# EAGLE design schematicFORLAMP (EAGLE 9.6.2)
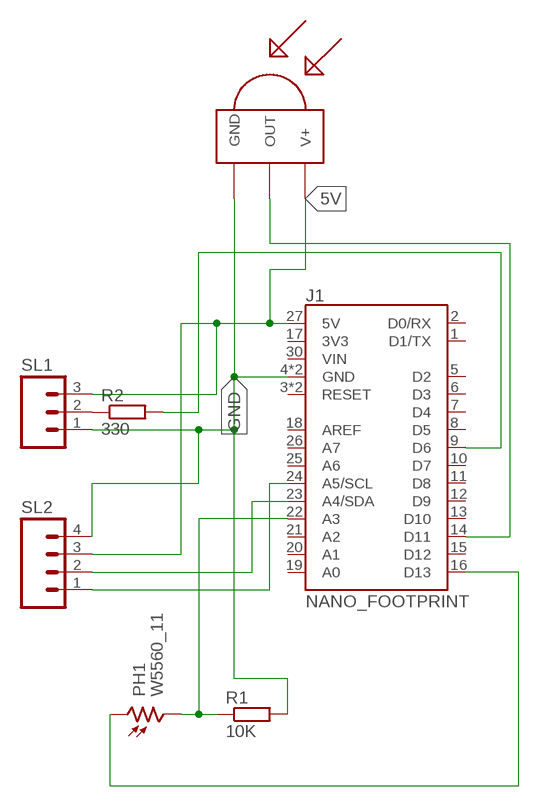
[diagram p0: schematic, sheet 1]

## Parts
J1  NANO_FOOTPRINT  [NANO]
PH1  W5560_11  [W55XX]
R1  10K  R-EU_0207/10  [0207/10]
R2  330  R-EU_0207/10  [0207/10]
SL1  M03  [03P]
SL2  M04  [04P]
U$1  TSOP1838  [TSOP18XX]

## Nets
5V: J1.27(5V) SL1.3 SL2.3 U$1.VCC(V+)
GND: J1.4(GND) J1.29(GND) R1.2 SL1.1 SL2.4 U$1.GND
N$1: R2.1 SL1.2
N$3: J1.9(D6) R2.2
N$5: J1.22(A3) PH1.2 R1.1
N$6: J1.14(D11) U$1.OUT
N$8: J1.16(D13) PH1.1
N$10: J1.23(A4/SDA) SL2.2
N$11: J1.24(A5/SCL) SL2.1
Unconnected: J1.1(D1/TX) J1.2(D0/RX) J1.3(RESET) J1.5(D2) J1.6(D3) J1.7(D4) J1.8(D5) J1.10(D7) J1.11(D8) J1.12(D9) J1.13(D10) J1.15(D12) J1.17(3V3) J1.18(AREF) J1.19(A0) J1.20(A1) J1.21(A2) J1.25(A6) J1.26(A7) J1.28(RESET) J1.30(VIN)

## Library data of the parts
J1 = SparkFun-Boards:NANO_FOOTPRINT: Generic Nano Footprint
PH1 = photo-elements:W55: Photo Sensor Oil Burner Control Applications Source: http://optoelectronics.perkinelmer.com/content/Datasheets/DTS_PhotocellsD1160.pdf
R1 R2 = rcl:R-EU_: RESISTOR, European symbol; SPICEPREFIX: R
SL1 = con-amp-quick:M03: AMP QUICK CONNECTOR; OC_FARNELL: unknown; OC_NEWARK: unknown
SL2 = con-amp-quick:M04: AMP QUICK CONNECTOR; OC_FARNELL: unknown; OC_NEWARK: unknown
U$1 = TSOP1838:TSOP1838: IR Receiver and Demodulator Check availability <https://pricing.snapeda.com/parts/TSOP1838/Vishay%20Semiconductors/view-part?ref=eda>; AVAILABILITY: Not in stock; DESCRIPTION: Infrared Receivers IR REMOTE SYS; MF: Vishay Semiconductors; MP: TSOP1838; PACKAGE: None; PRICE: None

## Board
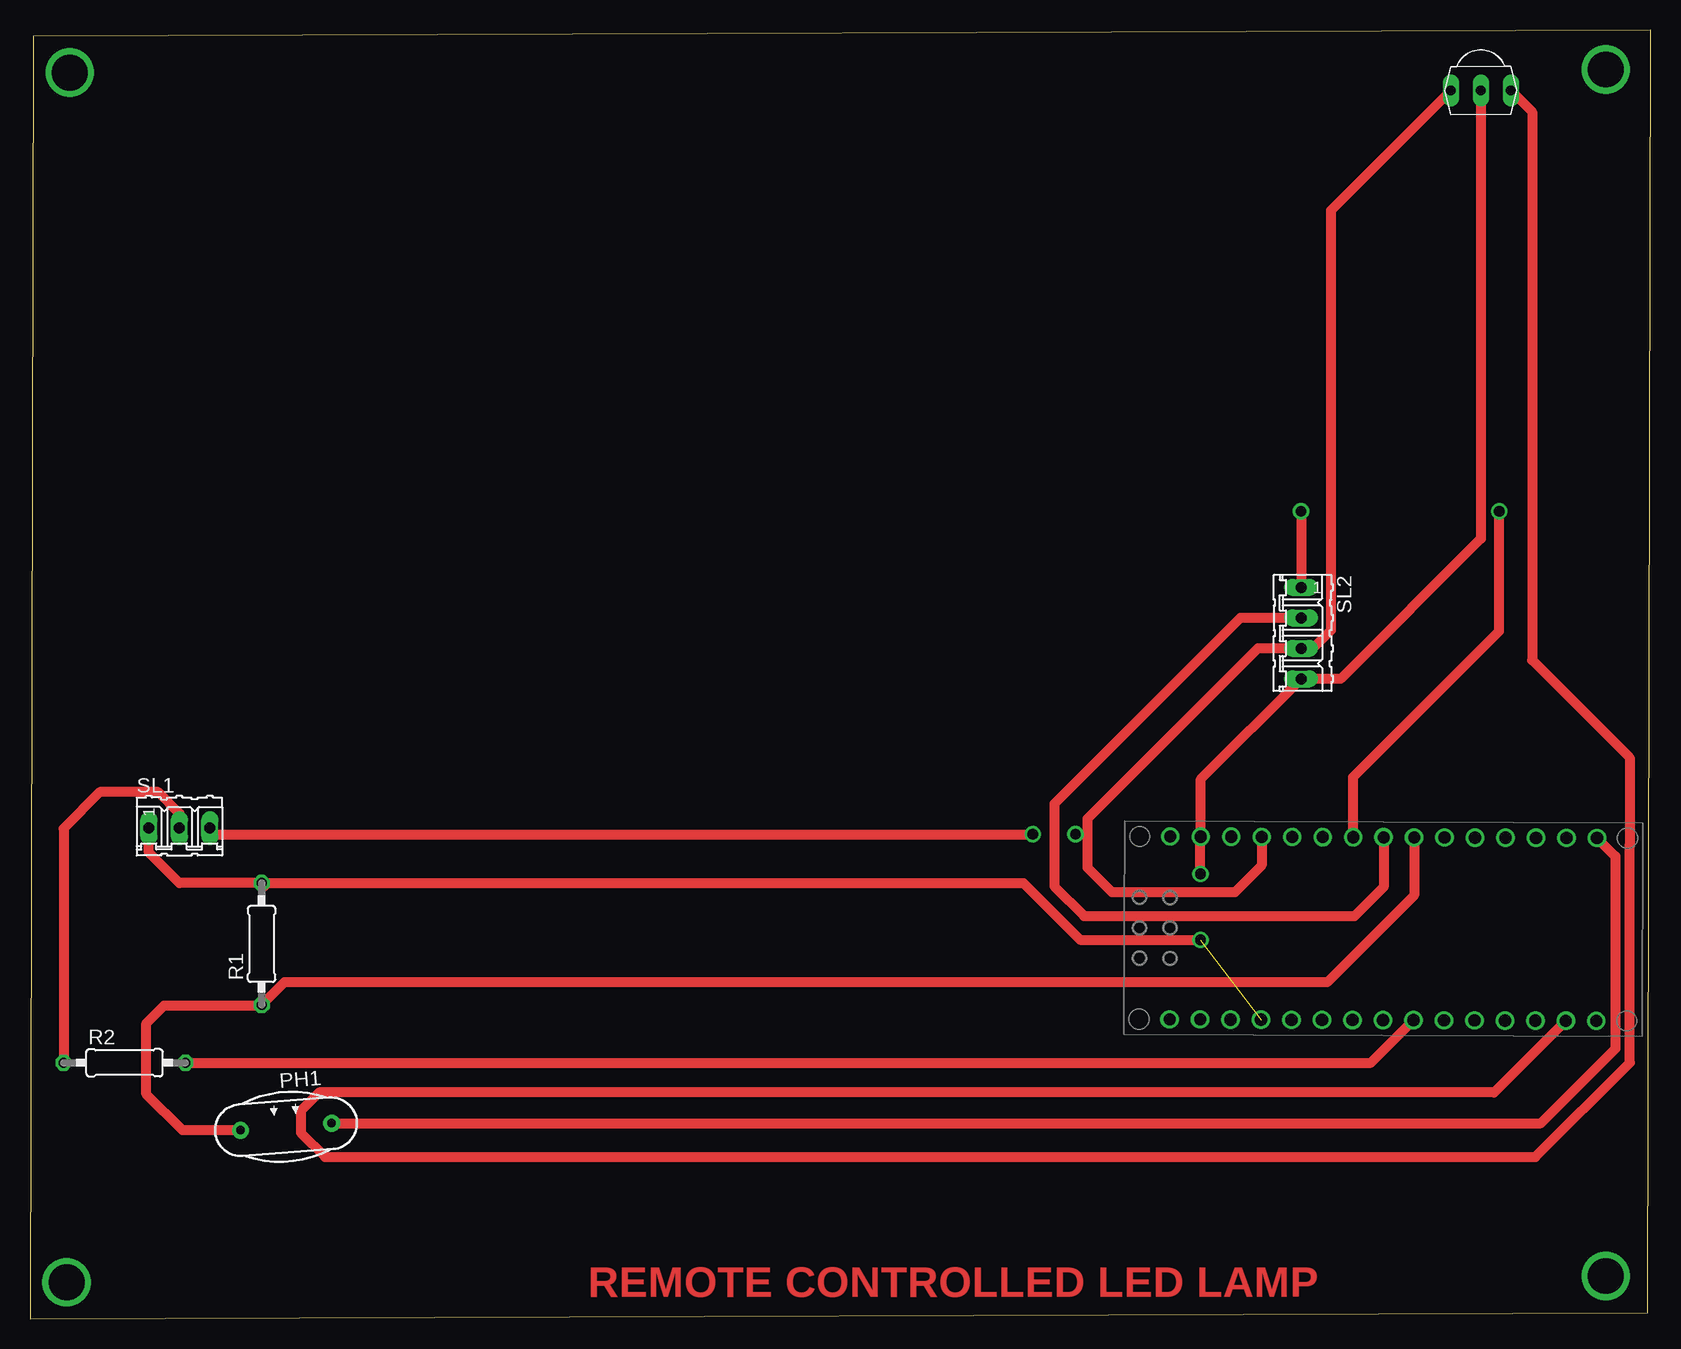
[diagram p1: board, top side]
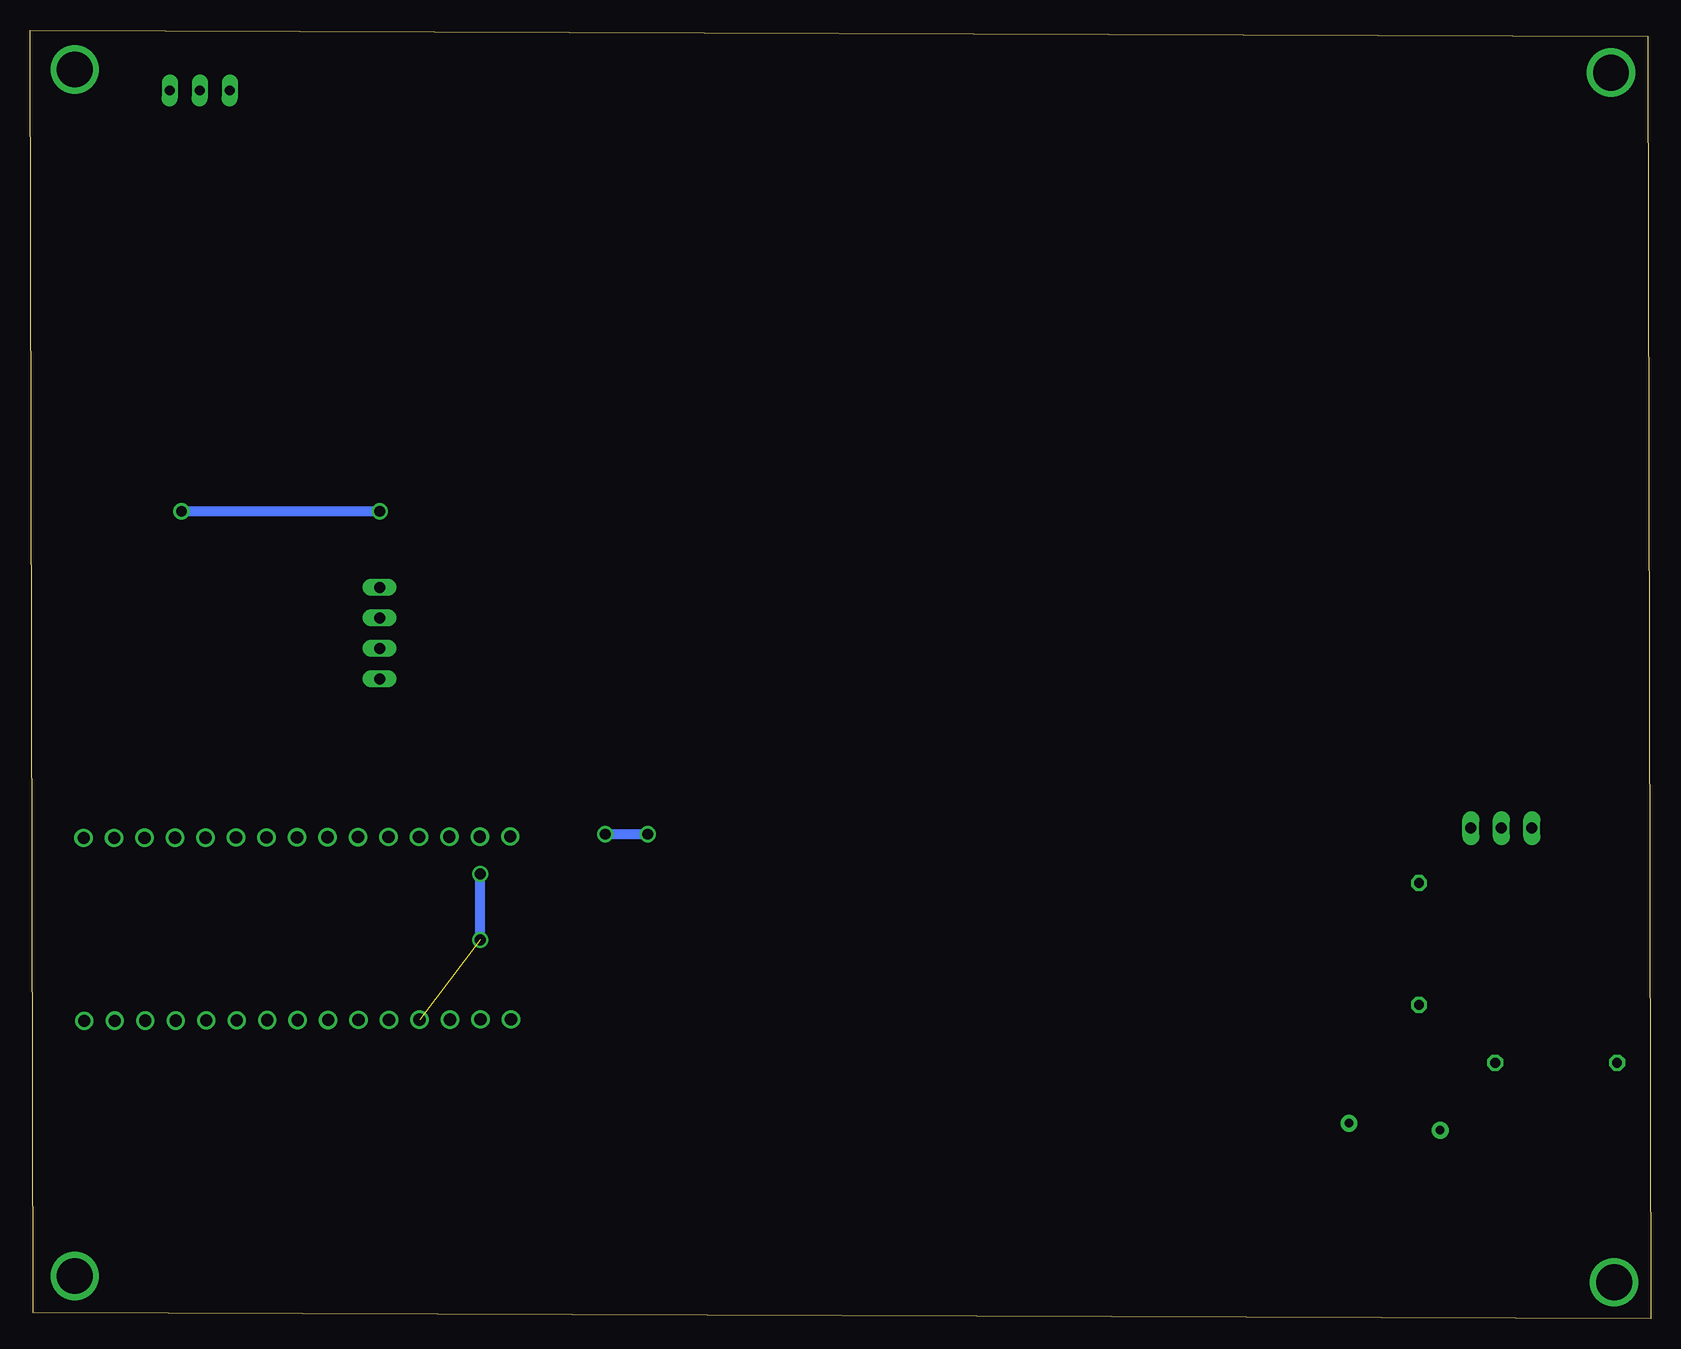
[diagram p2: board, bottom side, seen from below]

Size 135.05 x 107.43 mm. Coordinates in mm from the lower left corner, seen from the top.
Outline: 0,0 134.8,0.51 135.05,107.43 0.25,106.92 0,0
Copper layers (1*16): Top 0.035mm / dielectric 1.5mm / Bottom 0.035mm
Design rules "default": minimum track width 6mil, minimum drill 0.35mm, track to track 6mil, track to pad 6mil, pad to pad 6mil, via to via 6mil, smd to smd 6mil, copper to edge 40mil, drill to drill 6mil, minimum pad ring 10mil, minimum via ring 8mil, stop-mask expansion 4mil, vias tented up to drill 0mil, thermal gap 10mil

### Footprints (pad centres in the part's own frame; a part is rotated, then mirrored left to right if it is on the bottom)
NANO = drill 1.016: 1 -7.62,17.78; 2 -7.62,15.24; 3 -7.62,12.7; 4 -7.62,10.16; 5 -7.62,7.62; 6 -7.62,5.08; 7 -7.62,2.54; 8 -7.62,0; 9 -7.62,-2.54; 10 -7.62,-5.08; 11 -7.62,-7.62; 12 -7.62,-10.16; 13 -7.62,-12.7; 14 -7.62,-15.24; 15 -7.62,-17.78; 16 7.62,-17.78; 17 7.62,-15.24; 18 7.62,-12.7; 19 7.62,-10.16; 20 7.62,-7.62; 21 7.62,-5.08; 22 7.62,-2.54; 23 7.62,0; 24 7.62,2.54; 25 7.62,5.08; 26 7.62,7.62; 27 7.62,10.16; 28 7.62,12.7; 29 7.62,15.24; 30 7.62,17.78
W55XX = drill 0.7 pad 1.4: 1 -3.81,0; 2 3.81,0
0207/10 = drill 0.813 octagon: 1 -5.08,0; 2 5.08,0
03P = drill 0.914 long: 1 -2.54,0; 2 0,0; 3 2.54,0
04P = drill 0.914 long: 1 -3.81,0; 2 -1.27,0; 3 1.27,0; 4 3.81,0
TSOP18XX = drill 0.813 long: GND -0.001,-0.027; OUT -2.501,-0.027; VCC 2.499,-0.027

### Placement (x,y rotation side)
J1  112.78,32.51 89.8 top
PH1  21.34,16 184.4 top
R1  19.3,31.24 90 top
R2  7.87,21.34 0 top
SL1  12.45,40.89 0 top
SL2  105.92,57.15 270 top
U$1  120.9,102.36 180.1 top

### Tracks (layer width: path | path; a pad name or v marks a point on that pad's centre or on a via)
5V  (via drill 0.9)
  Top 0.813: 88.11,40.13 88.11,41.66 102.33,55.88 SL2.3 106.9,55.88 108.41,57.39 108.41,92.39 U$1.VCC | 88.11,40.13 88.11,37.62 90.18,35.55 100.4,35.55 102.64,37.8 J1.27 | SL1.3 15.49,40.39 v83.57,40.39 | v87.12,40.39 87.86,40.39 88.11,40.13
  Bottom 0.813: v83.57,40.39 v87.12,40.39
GND  (via drill 0.9)  (1 unrouted)
  Top 0.813: U$1.GND 120.91,65.03 109.22,53.34 SL2.4 97.56,44.98 J1.29 97.54,40.16 v97.54,37.08 | R1.2 12.45,36.32 9.91,38.86 SL1.1 | R1.2 19.56,36.07 | v97.54,31.59 87.51,31.59 82.78,36.32 R1.2
  Bottom 0.813: v97.54,31.59 v97.54,37.08
N$1
  Top 0.813: SL1.2 12.45,42.13 10.69,43.89 5.82,43.89 2.79,40.86 R2.1
N$3
  Top 0.813: R2.2 111.74,21.34 J1.9
N$5
  Top 0.813: J1.22 115.34,35.3 108.1,28.05 93.96,28.05 93.96,28.06 21.2,28.06 R1.1 19.25,26.11 11.18,26.11 9.7,24.63 9.7,18.72 12.71,15.71 PH1.2
N$6
  Top 0.813: J1.14 122.01,18.86 24.09,18.86 22.57,17.34 22.57,15.5 24.6,13.47 125.46,13.47 133.32,21.34 133.32,39.45 133.31,39.47 133.31,46.77 125.18,54.89 125.18,100.62 U$1.OUT
N$7  (via drill 3)
  other vias: 3.3,103.89
N$8
  Top 0.813: J1.16 132.11,38.55 132.11,22.5 125.9,16.29 PH1.1
N$9  (via drill 3)
  other vias: 131.32,3.56
N$10
  Top 0.813: SL2.2 100.87,58.42 85.37,42.92 85.37,36.04 87.84,33.57 110.39,33.57 112.8,35.98 J1.23
N$11  (via drill 0.9)
  Top 0.813: J1.24 110.26,45.14 122.43,57.31 v122.43,67.31 | v105.92,67.31 SL2.1
  Bottom 0.813: v122.43,67.31 v105.92,67.31
N$12  (via drill 3)
  other vias: 3.05,3.05
N$13  (via drill 3)
  other vias: 131.32,104.14

### Text on the board
Top: REMOTE CONTROLLED LED LAMP